# EAGLE schematic vfd (EAGLE 9.1.2)
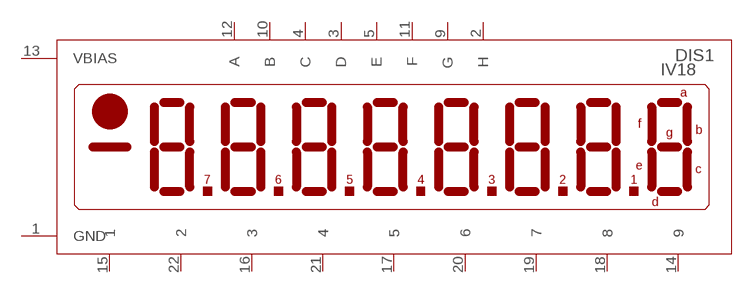
[diagram p0: schematic, sheet 1]

## Parts
DIS1  IV18  [IV18]
Unconnected: DIS1.1(GND) DIS1.2(H) DIS1.3(D) DIS1.4(C) DIS1.5(E) DIS1.9(G) DIS1.10(B) DIS1.11(F) DIS1.12(A) DIS1.13(VBIAS) DIS1.14 DIS1.15 DIS1.16 DIS1.17 DIS1.18 DIS1.19 DIS1.20 DIS1.21 DIS1.22

## Library data of the parts
DIS1 = taki-library:IV18: LCD DISPLAY 8-character 7 segment